# Altium schematic sheet SVPXGR740_3U.SchDoc: SVPXFMC Carrier 3U
size 420 x 297 mm; CheckedBy: \; Author: G.Kasprowicz; CompanyName: ISE; DrawnBy: T.Przywozki; Organization: WUT ISE; Address1: Warsaw University of Technology; Address2: Nowowiejska 15/19 00-665 Warsaw; Revision: 1.0.; SheetNumber: 1; SheetTotal: 20; ModifiedBy: -; CheckedDate: -; Title2: Top; DivGrp: ISE; Designer: G.Kasprowicz; Project: SVPXFMC Carrier 3U; ModifiedDate: -; ProjectName: FMC SFP 4
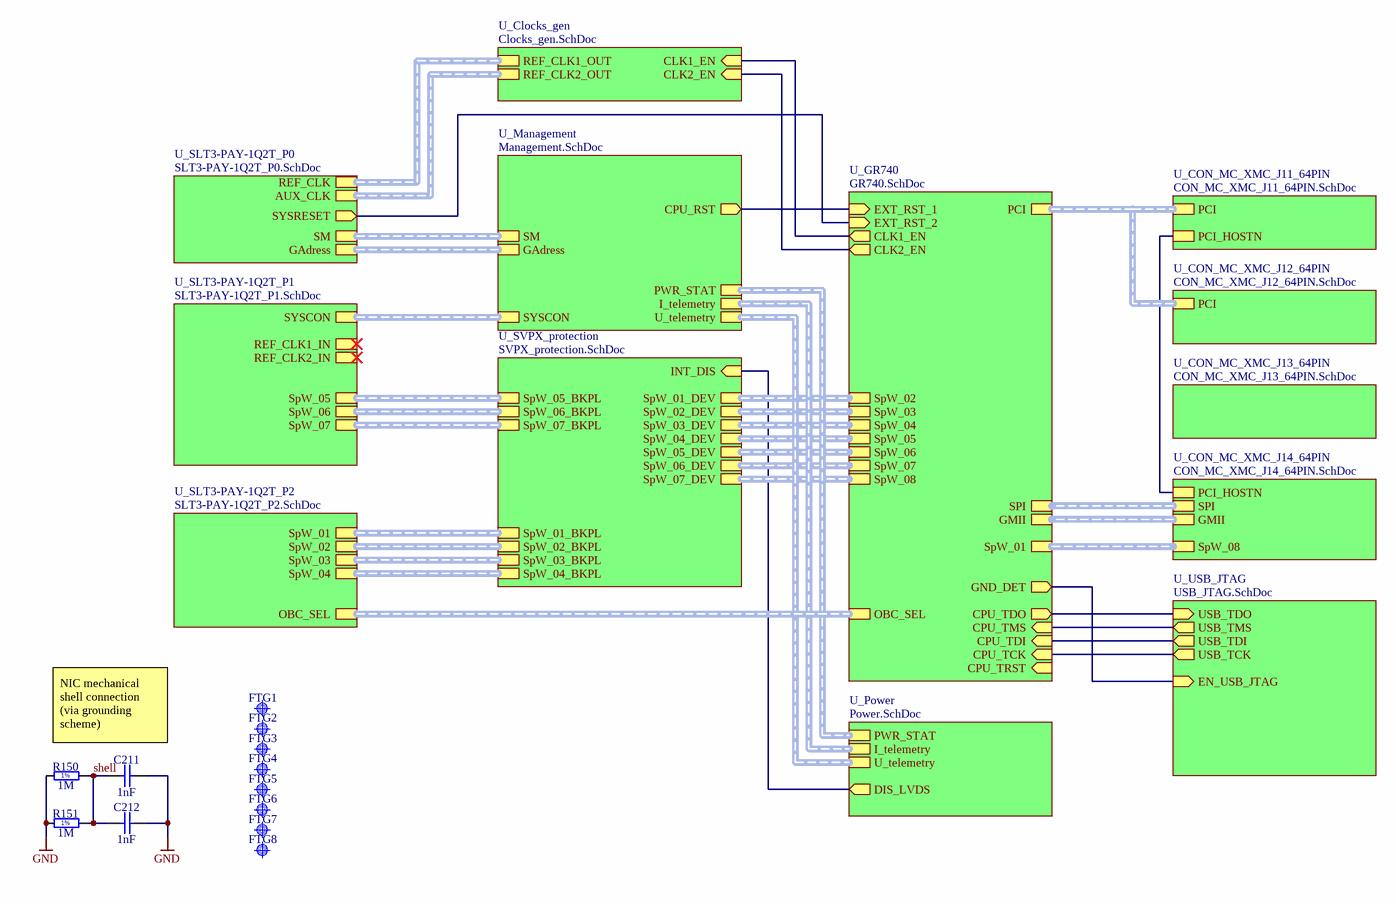
[diagram p0: SVPXGR740_3U.SchDoc]

## Parts
C211  1nF  [CAPC1005X55N]
C212  1nF  [CAPC1005X55N]
FTG1  Use only in PCB  [FIDUCIAL_TOP_C100-200]  (value not drawn)
FTG2  Use only in PCB  [FIDUCIAL_TOP_C100-200]  (value not drawn)
FTG3  Use only in PCB  [FIDUCIAL_TOP_C100-200]  (value not drawn)
FTG4  Use only in PCB  [FIDUCIAL_TOP_C100-200]  (value not drawn)
FTG5  Use only in PCB  [FIDUCIAL_TOP_C100-200]  (value not drawn)
FTG6  Use only in PCB  [FIDUCIAL_TOP_C100-200]  (value not drawn)
FTG7  Use only in PCB  [FIDUCIAL_TOP_C100-200]  (value not drawn)
FTG8  Use only in PCB  [FIDUCIAL_TOP_C100-200]  (value not drawn)
R150  1M  [RESC1005X40N]
R151  1M  [RESC1005X40N]

## Sub-sheets
U_Clocks_gen = Clocks_gen.SchDoc: REF_CLK1_OUT (harness CLK), REF_CLK2_OUT (harness CLK), CLK1_EN (in), CLK2_EN (in)
U_CON_MC_XMC_J11_64PIN = CON_MC_XMC_J11_64PIN.SchDoc: PCI (harness PCI), PCI_HOSTN
U_CON_MC_XMC_J12_64PIN = CON_MC_XMC_J12_64PIN.SchDoc: PCI (harness PCI)
U_CON_MC_XMC_J13_64PIN = CON_MC_XMC_J13_64PIN.SchDoc: no entries
U_CON_MC_XMC_J14_64PIN = CON_MC_XMC_J14_64PIN.SchDoc: PCI_HOSTN, SPI (harness SPI), GMII (harness GMII), SpW_08 (harness SpW)
U_GR740 = GR740.SchDoc: EXT_RST_1 (in), PCI (harness PCI), SPI (harness SPI), GMII (harness GMII), SpW_06 (harness SpW), SpW_05 (harness SpW), SpW_04 (harness SpW), SpW_03 (harness SpW), SpW_01 (harness SpW), SpW_07 (harness SpW), SpW_08 (harness SpW), SpW_02 (harness SpW), CPU_TDO (out), CPU_TMS (in), CPU_TDI (in), CPU_TCK (in), CPU_TRST (in), OBC_SEL (harness OBC_SEL), EXT_RST_2 (in), CLK1_EN (out), CLK2_EN (out), GND_DET (out)
U_Management = Management.SchDoc: SM (harness SM), GAdress (harness GAdress), U_telemetry (harness Umeas), I_telemetry (harness Imeas), PWR_STAT (harness PWR_STAT), SYSCON (harness SYSCON), CPU_RST (out)
U_Power = Power.SchDoc: I_telemetry (harness Imeas), U_telemetry (harness Umeas), PWR_STAT (harness PWR_STAT), DIS_LVDS (out)
U_SLT3-PAY-1Q2T_P0 = SLT3-PAY-1Q2T_P0.SchDoc: AUX_CLK (harness CLK), REF_CLK (harness CLK), GAdress (harness GAdress), SM (harness SM), SYSRESET (out)
U_SLT3-PAY-1Q2T_P1 = SLT3-PAY-1Q2T_P1.SchDoc: SYSCON (harness SYSCON), REF_CLK2_IN (harness CLK), REF_CLK1_IN (harness CLK), SpW_05 (harness SpW), SpW_06 (harness SpW), SpW_07 (harness SpW)
U_SLT3-PAY-1Q2T_P2 = SLT3-PAY-1Q2T_P2.SchDoc: SpW_02 (harness SpW), OBC_SEL (harness OBC_SEL), SpW_04 (harness SpW), SpW_03 (harness SpW), SpW_01 (harness SpW)
U_SVPX_protection = SVPX_protection.SchDoc: INT_DIS (in), SpW_01_BKPL (harness SpW), SpW_01_DEV (harness SpW), SpW_02_BKPL (harness SpW), SpW_03_BKPL (harness SpW), SpW_04_BKPL (harness SpW), SpW_05_BKPL (harness SpW), SpW_02_DEV (harness SpW), SpW_05_DEV (harness SpW), SpW_06_BKPL (harness SpW), SpW_07_BKPL (harness SpW), SpW_06_DEV (harness SpW), SpW_07_DEV (harness SpW), SpW_03_DEV (harness SpW), SpW_04_DEV (harness SpW)
U_USB_JTAG = USB_JTAG.SchDoc: USB_TDO (in), USB_TMS (out), USB_TDI (out), USB_TCK (out), EN_USB_JTAG (in)

## Nets
GND: C211.2 C212.2 R150.1 R151.1
shell: C211.1 C212.1 R150.2 R151.2
(unnamed): sheet U_SLT3-PAY-1Q2T_P0/SYSRESET, sheet U_GR740/EXT_RST_2
(unnamed): sheet U_SVPX_protection/INT_DIS, sheet U_Power/DIS_LVDS
(unnamed): sheet U_GR740/EXT_RST_1, sheet U_Management/CPU_RST
(unnamed): sheet U_GR740/CPU_TDO, sheet U_USB_JTAG/USB_TDO
(unnamed): sheet U_GR740/CPU_TMS, sheet U_USB_JTAG/USB_TMS
(unnamed): sheet U_GR740/CPU_TDI, sheet U_USB_JTAG/USB_TDI
(unnamed): sheet U_GR740/CPU_TCK, sheet U_USB_JTAG/USB_TCK
(unnamed): sheet U_GR740/CLK1_EN, sheet U_Clocks_gen/CLK1_EN
(unnamed): sheet U_GR740/CLK2_EN, sheet U_Clocks_gen/CLK2_EN
(unnamed): sheet U_GR740/GND_DET, sheet U_USB_JTAG/EN_USB_JTAG
(unnamed): sheet U_CON_MC_XMC_J11_64PIN/PCI_HOSTN, sheet U_CON_MC_XMC_J14_64PIN/PCI_HOSTN

## Buses and harness runs
harness sheet U_Clocks_gen/REF_CLK1_OUT = sheet U_SLT3-PAY-1Q2T_P0/REF_CLK
harness sheet U_Clocks_gen/REF_CLK2_OUT = sheet U_SLT3-PAY-1Q2T_P0/AUX_CLK
harness sheet U_CON_MC_XMC_J11_64PIN/PCI = sheet U_CON_MC_XMC_J12_64PIN/PCI = sheet U_GR740/PCI
harness sheet U_CON_MC_XMC_J14_64PIN/GMII = sheet U_GR740/GMII
harness sheet U_CON_MC_XMC_J14_64PIN/SPI = sheet U_GR740/SPI
harness sheet U_CON_MC_XMC_J14_64PIN/SpW_08 = sheet U_GR740/SpW_01
harness sheet U_GR740/OBC_SEL = sheet U_SLT3-PAY-1Q2T_P2/OBC_SEL
harness sheet U_GR740/SpW_02 = sheet U_SVPX_protection/SpW_01_DEV
harness sheet U_GR740/SpW_03 = sheet U_SVPX_protection/SpW_02_DEV
harness sheet U_GR740/SpW_04 = sheet U_SVPX_protection/SpW_03_DEV
harness sheet U_GR740/SpW_05 = sheet U_SVPX_protection/SpW_04_DEV
harness sheet U_GR740/SpW_06 = sheet U_SVPX_protection/SpW_05_DEV
harness sheet U_GR740/SpW_07 = sheet U_SVPX_protection/SpW_06_DEV
harness sheet U_GR740/SpW_08 = sheet U_SVPX_protection/SpW_07_DEV
harness sheet U_Management/GAdress = sheet U_SLT3-PAY-1Q2T_P0/GAdress
harness sheet U_Management/I_telemetry = sheet U_Power/I_telemetry
harness sheet U_Management/PWR_STAT = sheet U_Power/PWR_STAT
harness sheet U_Management/SM = sheet U_SLT3-PAY-1Q2T_P0/SM
harness sheet U_Management/SYSCON = sheet U_SLT3-PAY-1Q2T_P1/SYSCON
harness sheet U_Management/U_telemetry = sheet U_Power/U_telemetry
harness sheet U_SLT3-PAY-1Q2T_P1/SpW_05 = sheet U_SVPX_protection/SpW_05_BKPL
harness sheet U_SLT3-PAY-1Q2T_P1/SpW_06 = sheet U_SVPX_protection/SpW_06_BKPL
harness sheet U_SLT3-PAY-1Q2T_P1/SpW_07 = sheet U_SVPX_protection/SpW_07_BKPL
harness sheet U_SLT3-PAY-1Q2T_P2/SpW_01 = sheet U_SVPX_protection/SpW_01_BKPL
harness sheet U_SLT3-PAY-1Q2T_P2/SpW_02 = sheet U_SVPX_protection/SpW_02_BKPL
harness sheet U_SLT3-PAY-1Q2T_P2/SpW_03 = sheet U_SVPX_protection/SpW_03_BKPL
harness sheet U_SLT3-PAY-1Q2T_P2/SpW_04 = sheet U_SVPX_protection/SpW_04_BKPL

## Notes on the sheet
- NIC mechanical shell connection (via grounding scheme)
- Project/Equipment
- Document
- Designer
- Drawn by
- Check.by
- File
- Last Mod.
- Print Date
- Sheet
- Size
- A3
- of
- Rev
- Copyright WUT ISE 2019
  This documentation describes Open Hardware and is licensed under the CERN OHL v.1.1. You may redistribute and modify this documentation under the terms of the CERN OHL v1.1.
  (http://ohwr.org/CERNOHL). This documentation is dristributed WITHOUT ANY EXPRESS OR IMPLIED WARRANTY, INCLUDING OF MERCHANTABILITY, SATISFACTORY QUALITY AND FITNESS FOR A PARTICULAR PURPOSE. Please see the CERN OHL v.1.1 for applicable conditions
- (in symbol R0402_1M_1%_0.0625W_100PPM) 1%

## Library data of the parts
C211 C212 = CC0402_1NF_50V_10%_X7R: Non-polarised capacitor; Part Description: SMD Multilayer Chip Ceramic Capacitor; Manufacturer: GENERIC; Manufacturer1 Part Number: 223858715623; Voltage: 50V; TC: X7R; Tolerance: ±10%; Part Number: CC0402_1NF_50V_10%_X7R; Component Kind: Standard; Component Type: Standard; Pin Count: 2; Value: 1nF; Status: Not Recommended; Manufacturer Part Number: CC0402_1NF_50V_10%_X7R; Case: 0402; Mounted: Yes; Socket: No; SMD: Yes; Sense: No; Manufacturer1 Example: PHYCOMP; Manufacturer1 ComponentHeight: 0.55mm; HelpURL: \\cern.ch\dfs\Applications\Altium\Datasheets\CC0402_X7R_PHYCOMP.pdf; Author: CERN DEM JLC; CreateDate: 03.12.2007; LatestRevisionDate: 03.12.2007
FTG1-FTG8 = FIDUCIAL_TARGET_C100-200: Fiducial Target; Part Description: Round Fiducial Target, Top Layer, 1.0mm, Top Solder 2.0mm, Keepout =2.0mm; Mounted: No; Part Number: FIDUCIAL_TARGET_C100-200; Component Kind: Standard (No BOM); Component Type: Standard (No BOM); Pin Count: 1; Family: Fiducial; Socket: No; SMD: Yes; Sense: No; Status: None; ComponentHeight: 0mm; HelpURL: Undefined; Author: CERN DEM JLC; CreateDate: 09.02.2010; LatestRevisionDate: 04.04.2012; PackageDescription: Round Fiducial Target, Top Layer, 1.0mm, Top Solder 2.0mm, Keepout =2.0mm
R150 R151 = R0402_1M_1%_0.0625W_100PPM: Resistor - 1%; Part Description: General Purpose Thick Film Chip Resistor; Manufacturer: GENERIC; Manufacturer1 Part Number: 232270671005L; TC: ±100ppm/°C; PressFit: No; Part Number: R0402_1M_1%_0.0625W_100PPM; Component Kind: Standard; Component Type: Standard; Pin Count: 2; Value: 1M; Status: Not Recommended; Power: 0.0625W; Tolerance: ±1%; Manufacturer Part Number: R0402_1M_1%_0.0625W_100PPM; Case: 0402; Mounted: Yes; Sense: No; Socket: No; SMD: Yes; Manufacturer1 Example: YAGEO PHYCOMP; Manufacturer1 ComponentHeight: 0.4mm; HelpURL: \\cern.ch\dfs\Applications\Altium\Datasheets\R0402_Phycomp_RC0402.pdf; Author: CERN DEM JLC; CreateDate: 03.12.2007; LatestRevisionDate: 17.10.2012